# Altium schematic sheet adc_wing.SchDoc: POSEDGE ADC Wing
size A4; Organization: www.posedge.ir; Address1: TORANJ Inc.; Address2: Isfahan Science and; Address3: Technology Town, Isfahan; Address4: IRAN; Revision: B
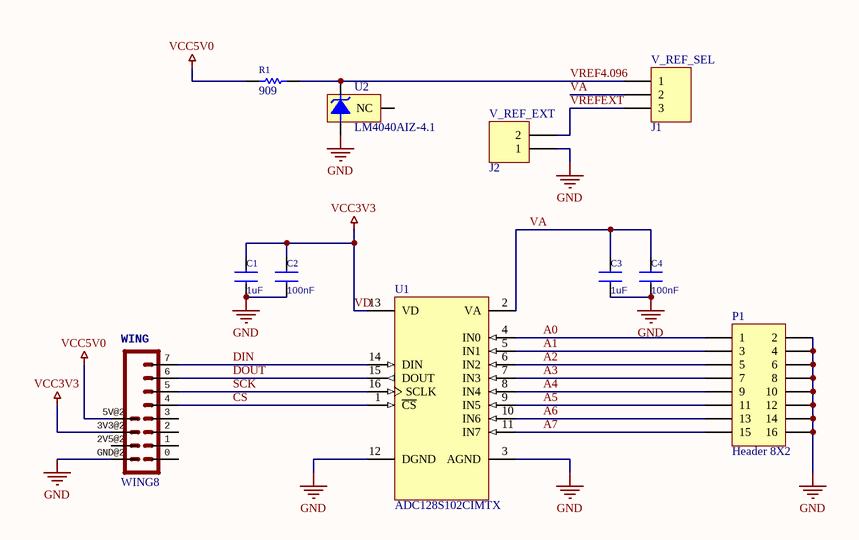
[diagram p0: adc_wing.SchDoc]

## Parts
C1  1uF  [C0805]
C2  100nF  [C0603]
C3  1uF  [C0805]
C4  100nF  [C0603]
J1  V_REF_SEL  [PLS-3-3D]
J2  V_REF_EXT  [PLS-2-3D]
P1  Header 8X2  [HDR2X8]
R1  909  [R0805]
U1  ADC128S102CIMTX  [MTC16_N]
U2  LM4040AIZ-4.1  [Z03A]
WING  WING8  [WINGSIDE_8BIT]

## Nets
GND: C1.1 C2.1 C3.1 C4.1 J2.1 P1.2 P1.4 P1.6 P1.8 P1.10 P1.12 P1.14 P1.16 U1.3(AGND) U1.12(DGND) U2.3(-V) WING.GND@2(GND)
VCC5V0: R1.1 WING.5V@2(5V)
VD: C1.2 C2.2 U1.13(VD) WING.3V3@2(3V3)  [also labelled VCC3V3]
A0: P1.1 U1.4(IN0)
A1: P1.3 U1.5(IN1)
A2: P1.5 U1.6(IN2)
A3: P1.7 U1.7(IN3)
A4: P1.9 U1.8(IN4)
A5: P1.11 U1.9(IN5)
A6: P1.13 U1.10(IN6)
A7: P1.15 U1.11(IN7)
CS: U1.1(~{CS}) WING.4
DIN: U1.14(DIN) WING.7
DOUT: U1.15(DOUT) WING.6
SCK: U1.16(SCLK) WING.5
VA: C3.2 C4.2 J1.2 U1.2(VA)
VREF4.096: J1.1 R1.2 U2.2(+V)
VREFEXT: J1.3 J2.2

Not connected (* = marked no-connect by the designer): U2 1(NC); WING 0(1) 1(2) 2(3) 2V5@2(2V5) 3(4)

## Notes on the sheet
- Title
- Size:
- Date:
- A4
- Number:
- Revision:
- Sheet
- of

## Library data of the parts
C1 C3 = C0805: Ceramic Capactor size 0805; Supplier: *; Value: 1uF
C2 C4 = C0603: Ceramic Capactor size 0603; Supplier: *; Value: 100nF
J1 = PLS-3: Header, 3-Pin; LatestRevisionDate: 17-Jul-2002; LatestRevisionNote: Re-released for DXP Platform.; Publisher: Altium Limited
J2 = PLS-2: Header, 2-Pin; LatestRevisionDate: 17-Jul-2002; LatestRevisionNote: Re-released for DXP Platform.; Publisher: Altium Limited
P1 = Header 8X2: Header, 8-Pin, Dual row; LatestRevisionDate: 17-Jul-2002; LatestRevisionNote: Re-released for DXP Platform.; Publisher: Altium Limited
R1 = R0805: Chip Resistor size 0805; Value: 909
U1 = ADC128S022CIMTX: 8-Channel, 50 kSPS to 200 kSPS, 12-Bit A/D Converter, 16-pin TSSOP; Manufacturer: National Semiconductor; PackageTopMarking: NSUZXYTT*128S022*CIMT; PowerWise: Y; CompType: ADC IC; DatasheetVersion: Feb-2010; PackageVersion: revD, Jun-2003; PackageReference: MTC16; PackageDescription: Molded TSSOP, Jedec, 5 x 4.4 x 0.9mm Body, 16 Lead, 0.65mm Pitch; PartNumber: ADC128S022CIMTX; RoHS: N; PinCount: 16; High-Reliability: Y; Code_JEDEC: MO-153-AB; ComponentLink1Description: ADC128S022 Datasheet; ComponentLink1URL: http://www.national.com/ds/AD/ADC128S022.pdf; ComponentLink2Description: ADC128S022 Web Page; ComponentLink2URL: http://www.national.com/pf/AD/ADC128S022.html; ComponentLink3Description: MTC16 Package Page; ComponentLink3URL: http://www.national.com/packaging/folders/mtc16.html
U2 = LM4040AIZ-4.1: Precision Micropower Shunt Voltage Reference, 3-pin TO-92; Manufacturer: National Semiconductor; PackageTopMarking: NSXYTT*4040A*IZ4.1; PowerWise: N; CompType: Voltage Reference IC; Published: 4-Dec-2008; LatestRevisionDate: 15-Jul-2009; LatestRevisionNote: Sch pins 1 & 3 reversed.; DatasheetVersion: Apr-2005; PackageVersion: revG, Sep-2000; PackageReference: Z03A; Publisher: Altium Limited; PackageDescription: TO-92, Molded, 3 Lead; PartNumber: LM4040AIZ-4.1; RoHS: N; PinCount: 3; Code_JEDEC: TO-226-AA; ComponentLink1Description: LM4040 Datasheet; ComponentLink1URL: http://www.national.com/ds/LM/LM4040.pdf; ComponentLink2Description: LM4040 Web Page; ComponentLink2URL: http://www.national.com/pf/LM/LM4040.html; ComponentLink3Description: Z03A Package Page; ComponentLink3URL: http://www.national.com/packaging/folders/z03a.html